# Altium project CPU_MOD.PrjPcb (part 2 of 2)
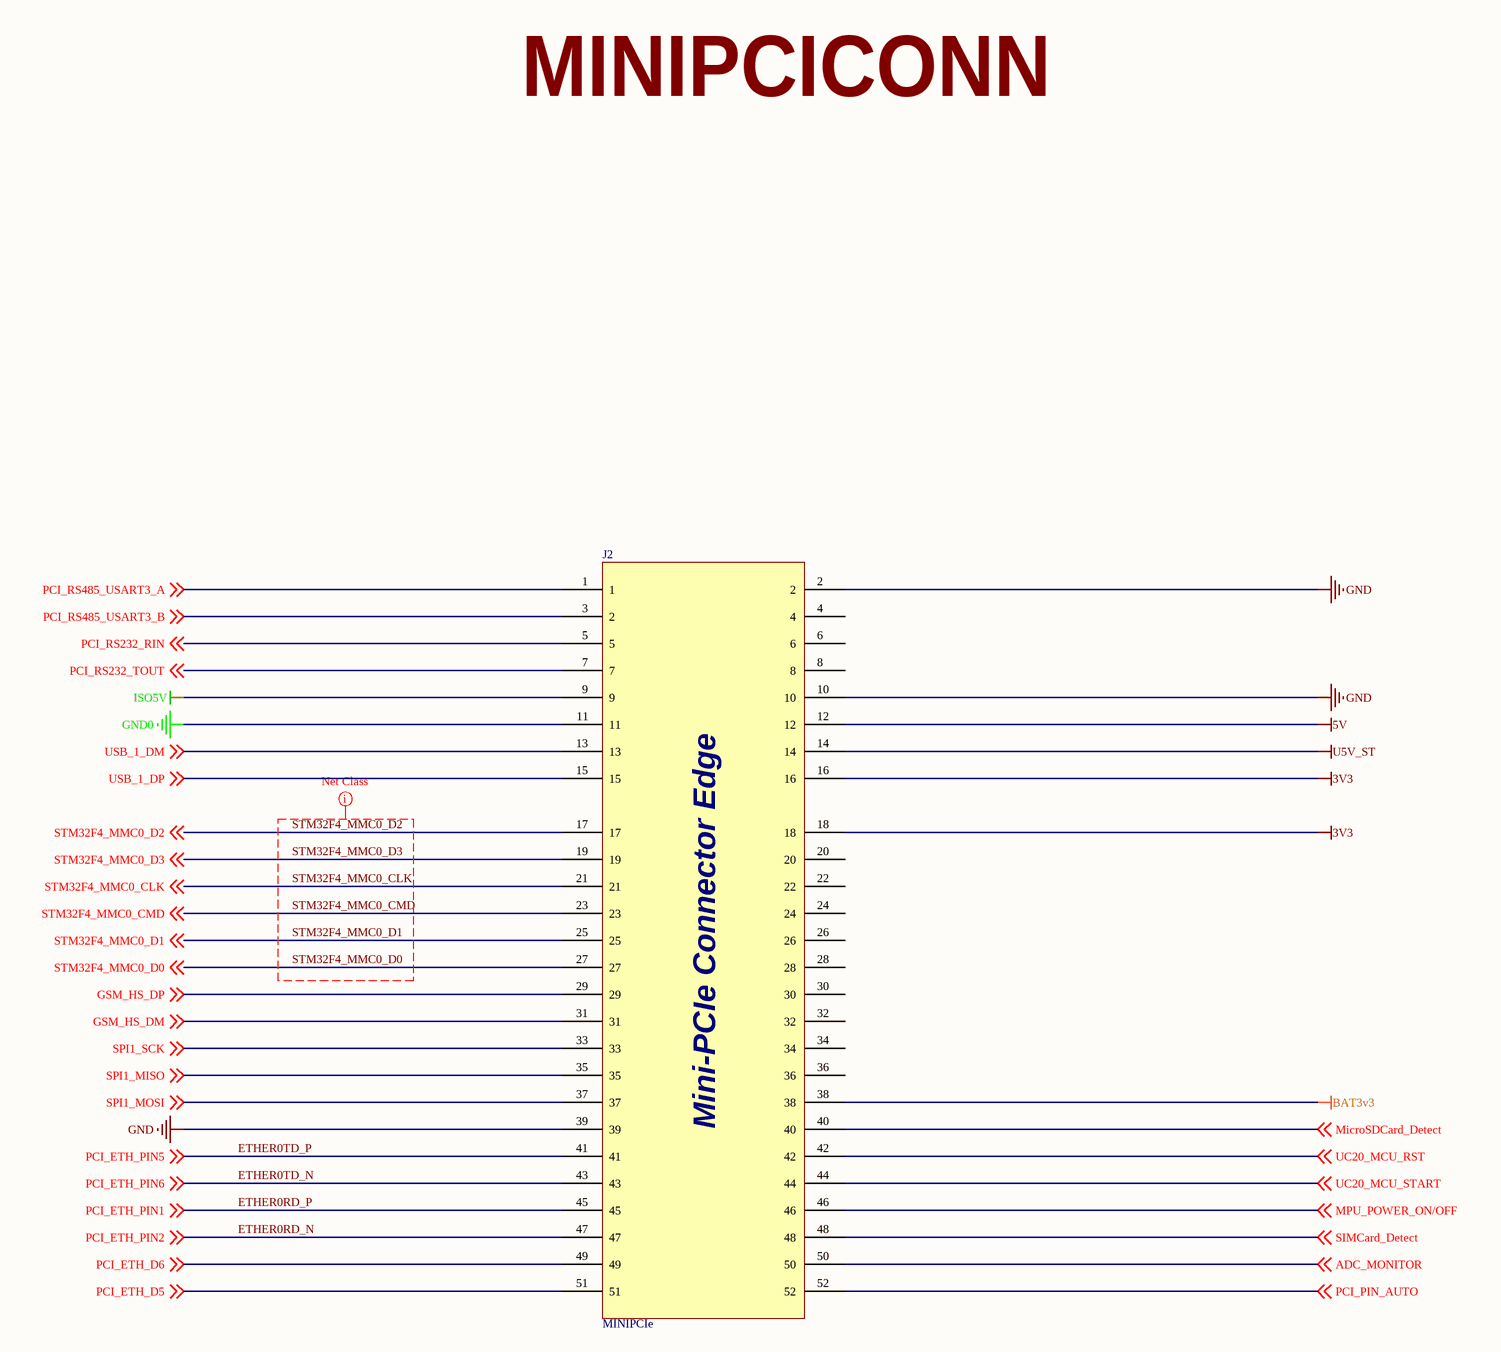
[diagram p6: [05] - MINIPCICONN.SchDoc]

## Nets that join several sheets
3V3: [01] - CPU (29 pins), [02] - RS232 (U4.16), [03] - RS485 (C41.2 U5.1), [04] - ETHERNET (24 pins), [05] - MINIPCICONN (J2.16 J2.18)
BAT3v3: [01] - CPU (U1.6), [05] - MINIPCICONN (J2.38)
GND: [01] - CPU (36 pins), [02] - RS232 (C39.1 C40.1 U4.15), [03] - RS485 (C41.1 U5.2 U5.7 U5.8), [04] - ETHERNET (18 pins), [05] - MINIPCICONN (J2.2 J2.10 J2.39)
GND0: [03] - RS485 (C35.1 U5.9 U5.10 U5.15), [05] - MINIPCICONN (J2.11)
ISO5V: [03] - RS485 (C35.2 U5.16), [05] - MINIPCICONN (J2.9)
U5V_ST: [01] - CPU (R1.1), [05] - MINIPCICONN (J2.14)
ADC_MONITOR: [01] - CPU (U1.19), [05] - MINIPCICONN (J2.50)
ETH0_ACTLED: [04] - ETHERNET (R9.1 U2.26), [05] - MINIPCICONN (J2.49)
ETH0_INT: [01] - CPU (U1.140), [04] - ETHERNET (R16.2 U2.7)
ETH0_LINKLED: [04] - ETHERNET (R7.1 U2.28), [05] - MINIPCICONN (J2.51)
ETH0_MII_COL: [01] - CPU (U1.37), [04] - ETHERNET (U2.42)
ETH0_MII_CRS: [01] - CPU (U1.34), [04] - ETHERNET (U2.40)
ETH0_MII_MD_CLK: [01] - CPU (U1.27), [04] - ETHERNET (R10.2 U2.31)
ETH0_MII_MD_IO: [01] - CPU (U1.36), [04] - ETHERNET (U2.30)
ETH0_RX_CLK: [01] - CPU (U1.35), [04] - ETHERNET (U2.38)
ETH0_RX_DV: [01] - CPU (U1.43), [04] - ETHERNET (U2.39)
ETH0_RX_ERR: [01] - CPU (U1.69), [04] - ETHERNET (U2.41)
ETH0_RXD_0: [01] - CPU (U1.44), [04] - ETHERNET (U2.43)
ETH0_RXD_1: [01] - CPU (U1.45), [04] - ETHERNET (U2.44)
ETH0_RXD_2: [01] - CPU (U1.46), [04] - ETHERNET (U2.45)
ETH0_RXD_3: [01] - CPU (U1.47), [04] - ETHERNET (U2.46)
ETH0_TX_CLK: [01] - CPU (U1.29), [04] - ETHERNET (U2.1)
ETH0_TX_EN: [01] - CPU (U1.70), [04] - ETHERNET (U2.2)
ETH0_TXD_0: [01] - CPU (U1.73), [04] - ETHERNET (U2.3)
ETH0_TXD_1: [01] - CPU (U1.74), [04] - ETHERNET (U2.4)
ETH0_TXD_2: [01] - CPU (U1.28), [04] - ETHERNET (U2.5)
ETH0_TXD_3: [01] - CPU (U1.139), [04] - ETHERNET (U2.6)
ETH0RST: [01] - CPU (J1.4 U1.25), [04] - ETHERNET (U3.2), [05] - MINIPCICONN (J2.52)
ETHER0RD_N: [04] - ETHERNET (R15.2 U2.13), [05] - MINIPCICONN (J2.47)
ETHER0RD_P: [04] - ETHERNET (R14.2 U2.14), [05] - MINIPCICONN (J2.45)
ETHER0TD_N: [04] - ETHERNET (R13.2 U2.16), [05] - MINIPCICONN (J2.43)
ETHER0TD_P: [04] - ETHERNET (R12.2 U2.17), [05] - MINIPCICONN (J2.41)
GSM_HS_DM: [01] - CPU (U1.75), [05] - MINIPCICONN (J2.31)
GSM_HS_DP: [01] - CPU (U1.76), [05] - MINIPCICONN (J2.29)
MicroSDCard_Detect: [01] - CPU (U1.12), [05] - MINIPCICONN (J2.40)
MPU_POWER_ON/OFF: [01] - CPU (U1.15), [05] - MINIPCICONN (J2.46)
PCI_RS232_RIN: [02] - RS232 (U4.13), [05] - MINIPCICONN (J2.5)
PCI_RS232_TOUT: [02] - RS232 (U4.14), [05] - MINIPCICONN (J2.7)
PCI_RS485_USART3_A: [03] - RS485 (U5.12), [05] - MINIPCICONN (J2.1)
PCI_RS485_USART3_B: [03] - RS485 (U5.13), [05] - MINIPCICONN (J2.3)
RS485_D: [01] - CPU (U1.77), [03] - RS485 (U5.6)
RS485_DE: [01] - CPU (U1.60), [03] - RS485 (U5.5)
RS485_R: [01] - CPU (U1.78), [03] - RS485 (U5.3)
RS485_RE: [01] - CPU (U1.59), [03] - RS485 (U5.4)
SIMCard_Detect: [01] - CPU (U1.18), [05] - MINIPCICONN (J2.48)
SPI1_MISO: [01] - CPU (U1.134), [05] - MINIPCICONN (J2.35)
SPI1_MOSI: [01] - CPU (U1.135), [05] - MINIPCICONN (J2.37)
SPI1_SCK: [01] - CPU (U1.133), [05] - MINIPCICONN (J2.33)
STM32F4_MMC0_CLK: [01] - CPU (U1.113), [05] - MINIPCICONN (J2.21)
STM32F4_MMC0_CMD: [01] - CPU (U1.116), [05] - MINIPCICONN (J2.23)
STM32F4_MMC0_D0: [01] - CPU (U1.98), [05] - MINIPCICONN (J2.27)
STM32F4_MMC0_D1: [01] - CPU (U1.99), [05] - MINIPCICONN (J2.25)
STM32F4_MMC0_D2: [01] - CPU (U1.111), [05] - MINIPCICONN (J2.17)
STM32F4_MMC0_D3: [01] - CPU (U1.112), [05] - MINIPCICONN (J2.19)
STM32F4_RS232_RX: [01] - CPU (U1.97), [02] - RS232 (U4.12)
STM32F4_RS232_TX: [01] - CPU (U1.96), [02] - RS232 (U4.11)
UC20_MCU_RST: [01] - CPU (U1.13), [05] - MINIPCICONN (J2.42)
UC20_MCU_START: [01] - CPU (U1.14), [05] - MINIPCICONN (J2.44)
USB_1_DM: [01] - CPU (R3.2), [05] - MINIPCICONN (J2.13)
USB_1_DP: [01] - CPU (R4.2), [05] - MINIPCICONN (J2.15)